# EAGLE schematic MultiCell (EAGLE 5.11)
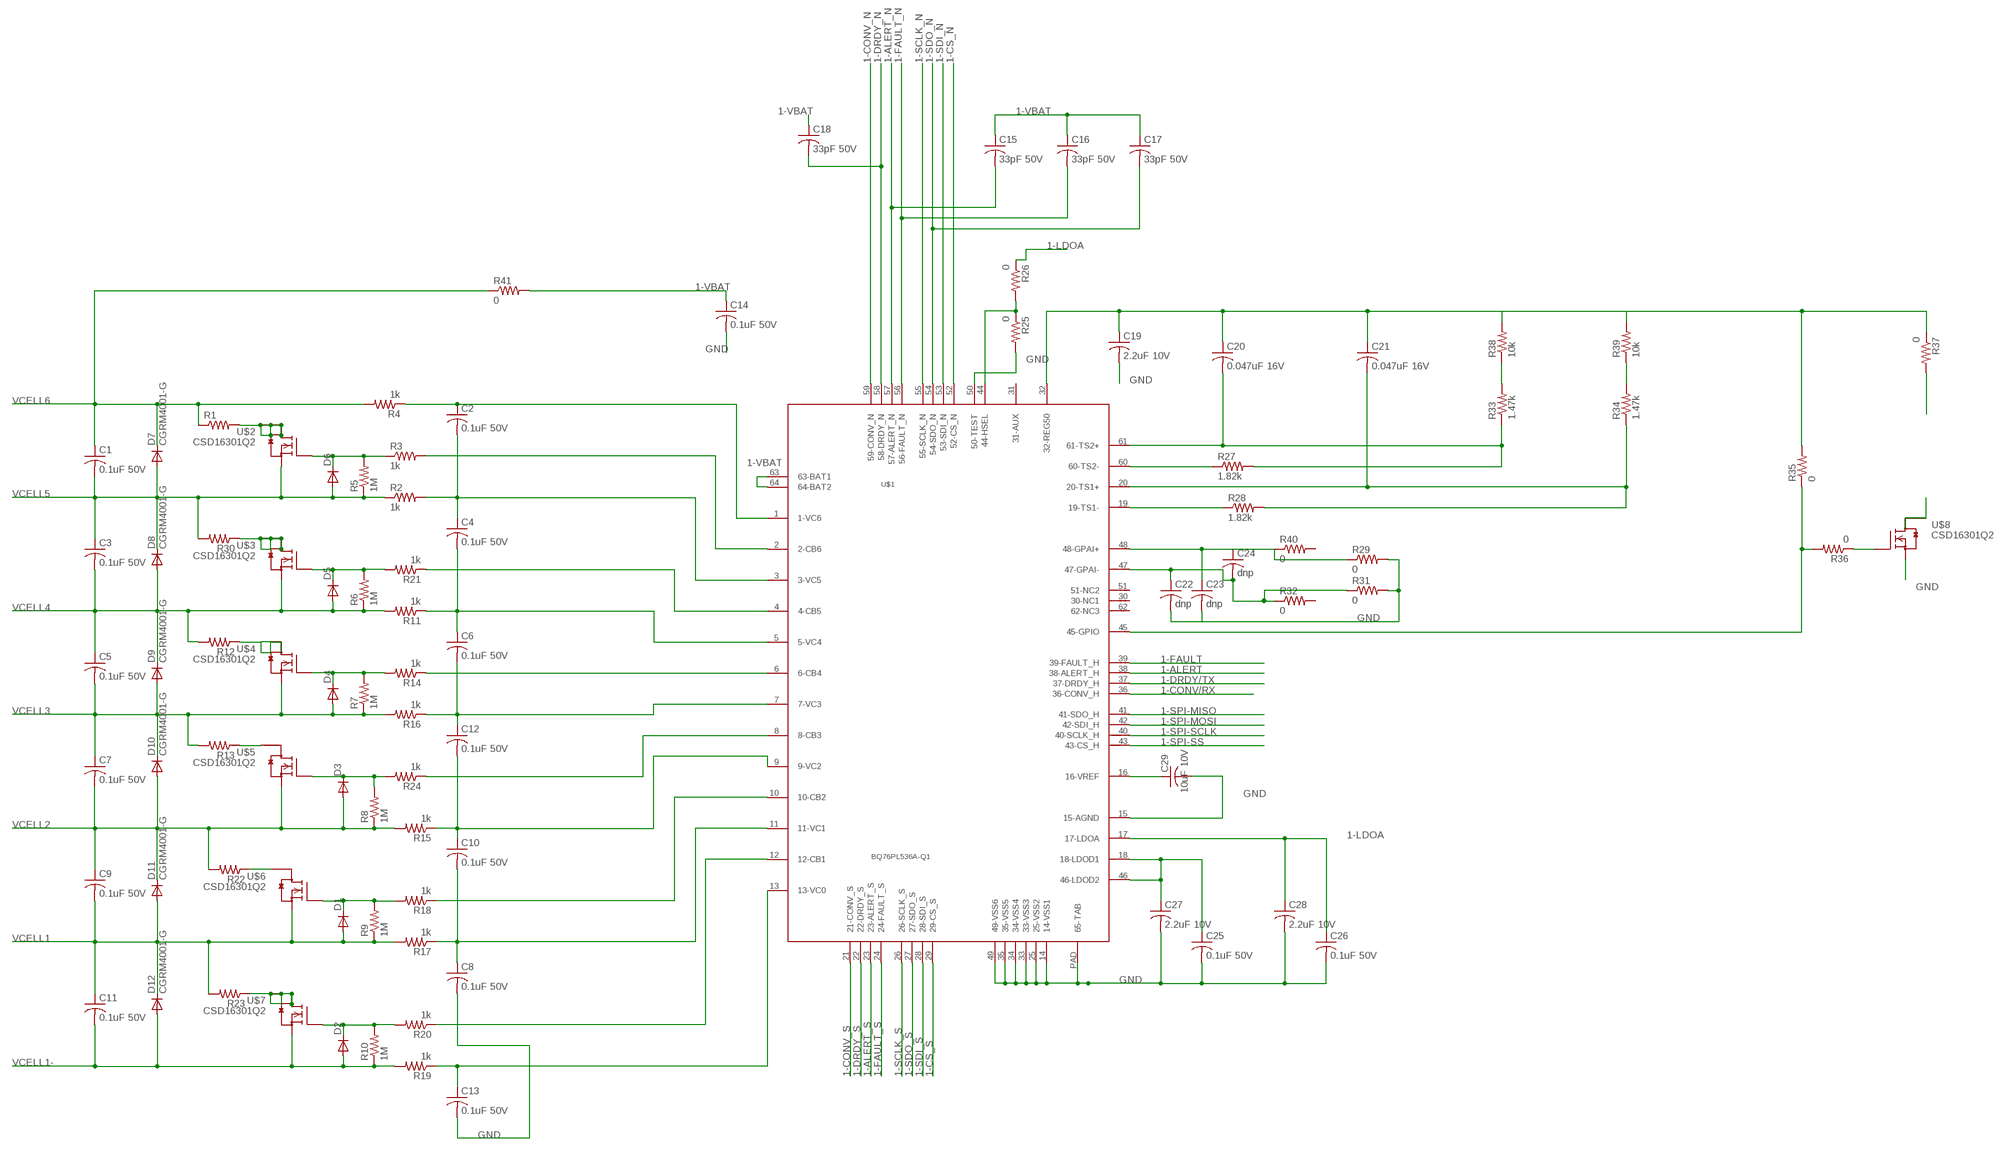
[diagram p0: schematic, sheet 1]

## Parts
C1  0.1uF 50V  C-USC0603  [C0603]
C2  0.1uF 50V  C-USC0603  [C0603]
C3  0.1uF 50V  C-USC0603  [C0603]
C4  0.1uF 50V  C-USC0603  [C0603]
C5  0.1uF 50V  C-USC0603  [C0603]
C6  0.1uF 50V  C-USC0603  [C0603]
C7  0.1uF 50V  C-USC0603  [C0603]
C8  0.1uF 50V  C-USC0603  [C0603]
C9  0.1uF 50V  C-USC0603  [C0603]
C10  0.1uF 50V  C-USC0603  [C0603]
C11  0.1uF 50V  C-USC0603  [C0603]
C12  0.1uF 50V  C-USC0603  [C0603]
C13  0.1uF 50V  C-USC0603  [C0603]
C14  0.1uF 50V  C-USC0603  [C0603]
C15  33pF 50V  C-USC0603  [C0603]
C16  33pF 50V  C-USC0603  [C0603]
C17  33pF 50V  C-USC0603  [C0603]
C18  33pF 50V  C-USC0603  [C0603]
C19  2.2uF 10V  C-USC0805  [C0805]
C20  0.047uF 16V  C-USC0603  [C0603]
C21  0.047uF 16V  C-USC0603  [C0603]
C22  dnp  C-USC0603  [C0603]
C23  dnp  C-USC0603  [C0603]
C24  dnp  C-USC0603  [C0603]
C25  0.1uF 50V  C-USC0603  [C0603]
C26  0.1uF 50V  C-USC0603  [C0603]
C27  2.2uF 10V  C-USC0805  [C0805]
C28  2.2uF 10V  C-USC0805  [C0805]
C29  10uF 10V  C-USC0805  [C0805]
D1  DIODESOD  [SOD-323]
D2  DIODESOD  [SOD-323]
D3  DIODESOD  [SOD-323]
D4  DIODESOD  [SOD-323]
D5  DIODESOD  [SOD-323]
D6  DIODESOD  [SOD-323]
D7  CGRM4001-G  [SOD-123_MINI-SMA]
D8  CGRM4001-G  [SOD-123_MINI-SMA]
D9  CGRM4001-G  [SOD-123_MINI-SMA]
D10  CGRM4001-G  [SOD-123_MINI-SMA]
D11  CGRM4001-G  [SOD-123_MINI-SMA]
D12  CGRM4001-G  [SOD-123_MINI-SMA]
R1  R-US_R2512  [R2512]
R2  1k  R-US_R0603  [R0603]
R3  1k  R-US_R0603  [R0603]
R4  1k  R-US_R0603  [R0603]
R5  1M  R-US_R0603  [R0603]
R6  1M  R-US_R0603  [R0603]
R7  1M  R-US_R0603  [R0603]
R8  1M  R-US_R0603  [R0603]
R9  1M  R-US_R0603  [R0603]
R10  1M  R-US_R0603  [R0603]
R11  1k  R-US_R0603  [R0603]
R12  R-US_R2512  [R2512]
R13  R-US_R2512  [R2512]
R14  1k  R-US_R0603  [R0603]
R15  1k  R-US_R0603  [R0603]
R16  1k  R-US_R0603  [R0603]
R17  1k  R-US_R0603  [R0603]
R18  1k  R-US_R0603  [R0603]
R19  1k  R-US_R0603  [R0603]
R20  1k  R-US_R0603  [R0603]
R21  1k  R-US_R0603  [R0603]
R22  R-US_R2512  [R2512]
R23  R-US_R2512  [R2512]
R24  1k  R-US_R0603  [R0603]
R25  0  R-US_R0603  [R0603]
R26  0  R-US_R0603  [R0603]
R27  1.82k  R-US_R0603  [R0603]
R28  1.82k  R-US_R0603  [R0603]
R29  0  R-US_R0603  [R0603]
R30  R-US_R2512  [R2512]
R31  0  R-US_R0603  [R0603]
R32  0  R-US_R0603  [R0603]
R33  1.47k  R-US_R0603  [R0603]
R34  1.47k  R-US_R0603  [R0603]
R35  0  R-US_R0603  [R0603]
R36  0  R-US_R0603  [R0603]
R37  0  R-US_R0603  [R0603]
R38  10k  R-US_R0603  [R0603]
R39  10k  R-US_R0603  [R0603]
R40  0  R-US_R0603  [R0603]
R41  0  R-US_R0603  [R0603]
U$1  BQ76PL536A-Q1  [TQFP-64]
U$2  CSD16301Q2  [TIMOS]
U$3  CSD16301Q2  [TIMOS]
U$4  CSD16301Q2  [TIMOS]
U$5  CSD16301Q2  [TIMOS]
U$6  CSD16301Q2  [TIMOS]
U$7  CSD16301Q2  [TIMOS]
U$8  CSD16301Q2  [TIMOS]

## Nets
1-ALERT: U$1.38(38-ALERT_H)
1-ALERT_N: C15.2 U$1.57(57-ALERT_N)
1-ALERT_S: U$1.23(23-ALERT_S)
1-CONV/RX: U$1.36(36-CONV_H)
1-CONV_N: U$1.59(59-CONV_N)
1-CONV_S: U$1.21(21-CONV_S)
1-CS_N: U$1.52(52-CS_N)
1-CS_S: U$1.29(29-CS_S)
1-DRDY/TX: U$1.37(37-DRDY_H)
1-DRDY_N: C18.2 U$1.58(58-DRDY_N)
1-DRDY_S: U$1.22(22-DRDY_S)
1-FAULT: U$1.39(39-FAULT_H)
1-FAULT_N: C16.2 U$1.56(56-FAULT_N)
1-FAULT_S: U$1.24(24-FAULT_S)
1-LDOA: C26.1 C28.1 R26.1 U$1.17(17-LDOA)
1-SCLK_N: U$1.55(55-SCLK_N)
1-SCLK_S: U$1.26(26-SCLK_S)
1-SDI_N: U$1.53(53-SDI_N)
1-SDI_S: U$1.28(28-SDI_S)
1-SDO_N: C17.2 U$1.54(54-SDO_N)
1-SDO_S: U$1.27(27-SDO_S)
1-SPI-MISO: U$1.41(41-SDO_H)
1-SPI-MOSI: U$1.42(42-SDI_H)
1-SPI-SCLK: U$1.40(40-SCLK_H)
1-SPI-SS: U$1.43(43-CS_H)
1-VBAT: C14.1 C15.1 C16.1 C17.1 C18.1 R41.2 U$1.63(63-BAT1) U$1.64(64-BAT2)
GND: C8.2 C13.2 C14.2 C19.2 C22.2 C23.2 C25.2 C26.2 C27.2 C28.2 C29.2 R25.2 R29.2 R31.2 U$1.14(14-VSS1) U$1.15(15-AGND) U$1.25(25-VSS2) U$1.33(33-VSS3) U$1.34(34-VSS4) U$1.35(35-VSS5) U$1.49(49-VSS6) U$1.50(50-TEST) U$1.PAD(65-TAB) U$8.4(S)
N$2: C2.1 R4.1 U$1.1(1-VC6)
N$3: C2.2 C4.1 R2.2 U$1.3(3-VC5)
N$4: R21.1 U$1.4(4-CB5)
N$5: R1.2 U$2.1(D) U$2.2(D) U$2.5(D) U$2.6(D)
N$6: D6.1(C) R3.1 R5.2 U$2.3(G)
N$7: R3.2 U$1.2(2-CB6)
N$9: R30.1 U$3.1(D) U$3.2(D) U$3.5(D) U$3.6(D)
N$10: C4.2 C6.1 R11.1 U$1.5(5-VC4)
N$12: D5.1(C) R6.2 R21.2 U$3.3(G)
N$13: R13.1 U$5.5(D)
N$15: C6.2 C12.1 R16.1 U$1.7(7-VC3)
N$16: R14.1 U$1.6(6-CB4)
N$17: D4.1(C) R7.2 R14.2 U$4.3(G)
N$18: R12.1 U$4.1(D) U$4.2(D) U$4.5(D) U$4.6(D)
N$20: R18.1 U$1.10(10-CB2)
N$21: D3.1(C) R8.2 R24.2 U$5.3(G)
N$22: C10.1 C12.2 R15.1 U$1.9(9-VC2)
N$24: D1.1(C) R9.2 R18.2 U$6.3(G)
N$25: R22.1 U$6.5(D)
N$26: C8.1 C10.2 R17.1 U$1.11(11-VC1)
N$27: R24.1 U$1.8(8-CB3)
N$29: D2.1(C) R10.2 R20.2 U$7.3(G)
N$30: R20.1 U$1.12(12-CB1)
N$31: C13.1 R19.1 U$1.13(13-VC0)
N$32: R23.1 U$7.1(D) U$7.2(D) U$7.5(D) U$7.6(D)
N$33: C19.1 C20.1 C21.1 R35.2 R37.1 R38.2 R39.2 U$1.32(32-REG50)
N$34: R25.1 R26.2 U$1.44(44-HSEL)
N$35: C20.2 R27.2 R33.1 U$1.61(61-TS2+)
N$36: R27.1 U$1.60(60-TS2-)
N$37: R37.2
N$38: R33.2 R38.1
N$39: R34.2 R39.1
N$40: C21.2 R28.2 R34.1 U$1.20(20-TS1+)
N$41: R28.1 U$1.19(19-TS1-)
N$42: U$8.1(D) U$8.2(D) U$8.5(D) U$8.6(D)
N$43: R36.1 U$8.3(G)
N$44: R35.1 R36.2 U$1.45(45-GPIO)
N$45: C23.1 C24.1 R29.1 R40.1 U$1.48(48-GPAI+)
N$47: C29.1 U$1.16(16-VREF)
N$48: C22.1 C24.2 R31.1 R32.1 U$1.47(47-GPAI-)
N$50: C25.1 C27.1 U$1.18(18-LDOD1) U$1.46(46-LDOD2)
VCELL1: C9.2 C11.1 D1.2(A) D11.A D12.C R9.1 R17.2 R23.2 U$6.4(S)
VCELL1-: C11.2 D2.2(A) D12.A R10.1 R19.2 U$7.4(S)
VCELL2: C7.2 C9.1 D3.2(A) D10.A D11.C R8.1 R15.2 R22.2 U$5.4(S)
VCELL3: C5.2 C7.1 D4.2(A) D9.A D10.C R7.1 R13.2 R16.2 U$4.4(S)
VCELL4: C3.2 C5.1 D5.2(A) D8.A D9.C R6.1 R11.2 R12.2 U$3.4(S)
VCELL5: C1.2 C3.1 D6.2(A) D7.A D8.C R2.1 R5.1 R30.2 U$2.4(S)
VCELL6: C1.1 D7.C R1.1 R4.2 R41.1
Unconnected: R32.2 R40.2 U$1.30(30-NC1) U$1.31(31-AUX) U$1.51(51-NC2) U$1.62(62-NC3) U$5.1(D) U$5.2(D) U$5.6(D) U$6.1(D) U$6.2(D) U$6.6(D)

## Library data of the parts
C1-C29 = rcl:C-US: CAPACITOR, American symbol
D1-D6 = SparkFun:DIODE: Diode These are standard reverse protection diodes and small signal diodes. SMA package can handle up to about 1A. SOD-323 can handle about 200mA. What the SOD-323 package when ordering, there are some mfgs out there that are 5-pin packages.
D7-D12 = diode:CGRM400*-G: Molded plasitc,JEDEC SOD-123/Mini SMA Source: Comchip CGRM4001-G.pdf
R1-R41 = rcl:R-US_: RESISTOR, American symbol
U$1 = m-pad-2.1:BQ76PL536A-Q1
U$2-U$8 = m-pad-2.1:CSD16301Q2